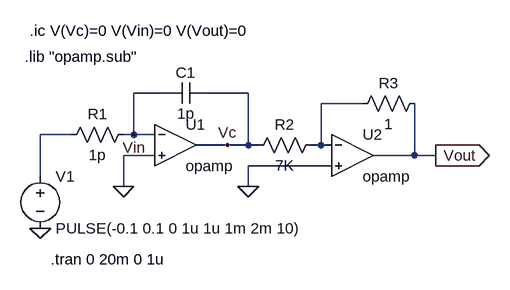
[diagram p0: schematic Draft5.asc]
Draft5.asc, the LTspice schematic file:
Version 4
SHEET 1 880 680
WIRE 224 16 176 16
WIRE 352 16 288 16
WIRE 528 32 464 32
WIRE 80 80 32 80
WIRE 176 80 176 16
WIRE 176 80 160 80
WIRE 208 80 176 80
WIRE 320 96 272 96
WIRE 352 96 352 16
WIRE 352 96 320 96
WIRE 368 96 352 96
WIRE 464 96 464 32
WIRE 464 96 448 96
WIRE 480 96 464 96
WIRE 208 112 160 112
WIRE 608 112 608 32
WIRE 608 112 544 112
WIRE 640 112 608 112
WIRE 480 128 352 128
WIRE 32 144 32 80
WIRE 160 160 160 112
WIRE 352 160 352 128
FLAG 160 160 0
FLAG 640 112 Vout
IOPIN 640 112 Out
FLAG 32 224 0
FLAG 352 160 0
FLAG 320 96 Vc
FLAG 176 80 Vin
SYMBOL voltage 32 128 R0
WINDOW 123 0 0 Left 0
WINDOW 39 0 0 Left 0
SYMATTR InstName V1
SYMATTR Value PULSE(-0.1 0.1 0 1u 1u 1m 2m 10)
SYMBOL res 176 64 R90
WINDOW 0 0 56 VBottom 2
WINDOW 3 32 56 VTop 2
SYMATTR InstName R1
SYMATTR Value 1p
SYMBOL cap 288 0 R90
WINDOW 0 0 32 VBottom 2
WINDOW 3 32 32 VTop 2
SYMATTR InstName C1
SYMATTR Value 1p
SYMBOL OpAmps\\opamp 240 32 R0
SYMATTR InstName U1
SYMBOL OpAmps\\opamp 512 48 R0
SYMATTR InstName U2
SYMBOL res 464 80 R90
WINDOW 0 0 56 VBottom 2
WINDOW 3 32 56 VTop 2
SYMATTR InstName R2
SYMATTR Value 7K
SYMBOL res 624 16 R90
WINDOW 0 0 56 VBottom 2
WINDOW 3 32 56 VTop 2
SYMATTR InstName R3
SYMATTR Value 1
TEXT 48 272 Left 2 !.tran 0 20m 0 1u
TEXT 8 -40 Left 2 !.lib "opamp.sub"
TEXT 16 -80 Left 2 !.ic V(Vc)=0 V(Vin)=0 V(Vout)=0

The netlist it stands for:
* Draft5.asc
V1 N002 0 PULSE(-0.1 0.1 0 1u 1u 1m 2m 10)
R1 Vin N002 1p
C1 Vc Vin 1p
XU1 Vin 0 Vc opamp Aol=100K GBW=10Meg  ; pins invin noninvin out
XU2 N001 0 Vout opamp Aol=100K GBW=10Meg  ; pins invin noninvin out
R2 N001 Vc 7K
R3 Vout N001 1
.tran 0 20m 0 1u
.lib "opamp.sub"
.ic V(Vc)=0 V(Vin)=0 V(Vout)=0
.backanno
.end